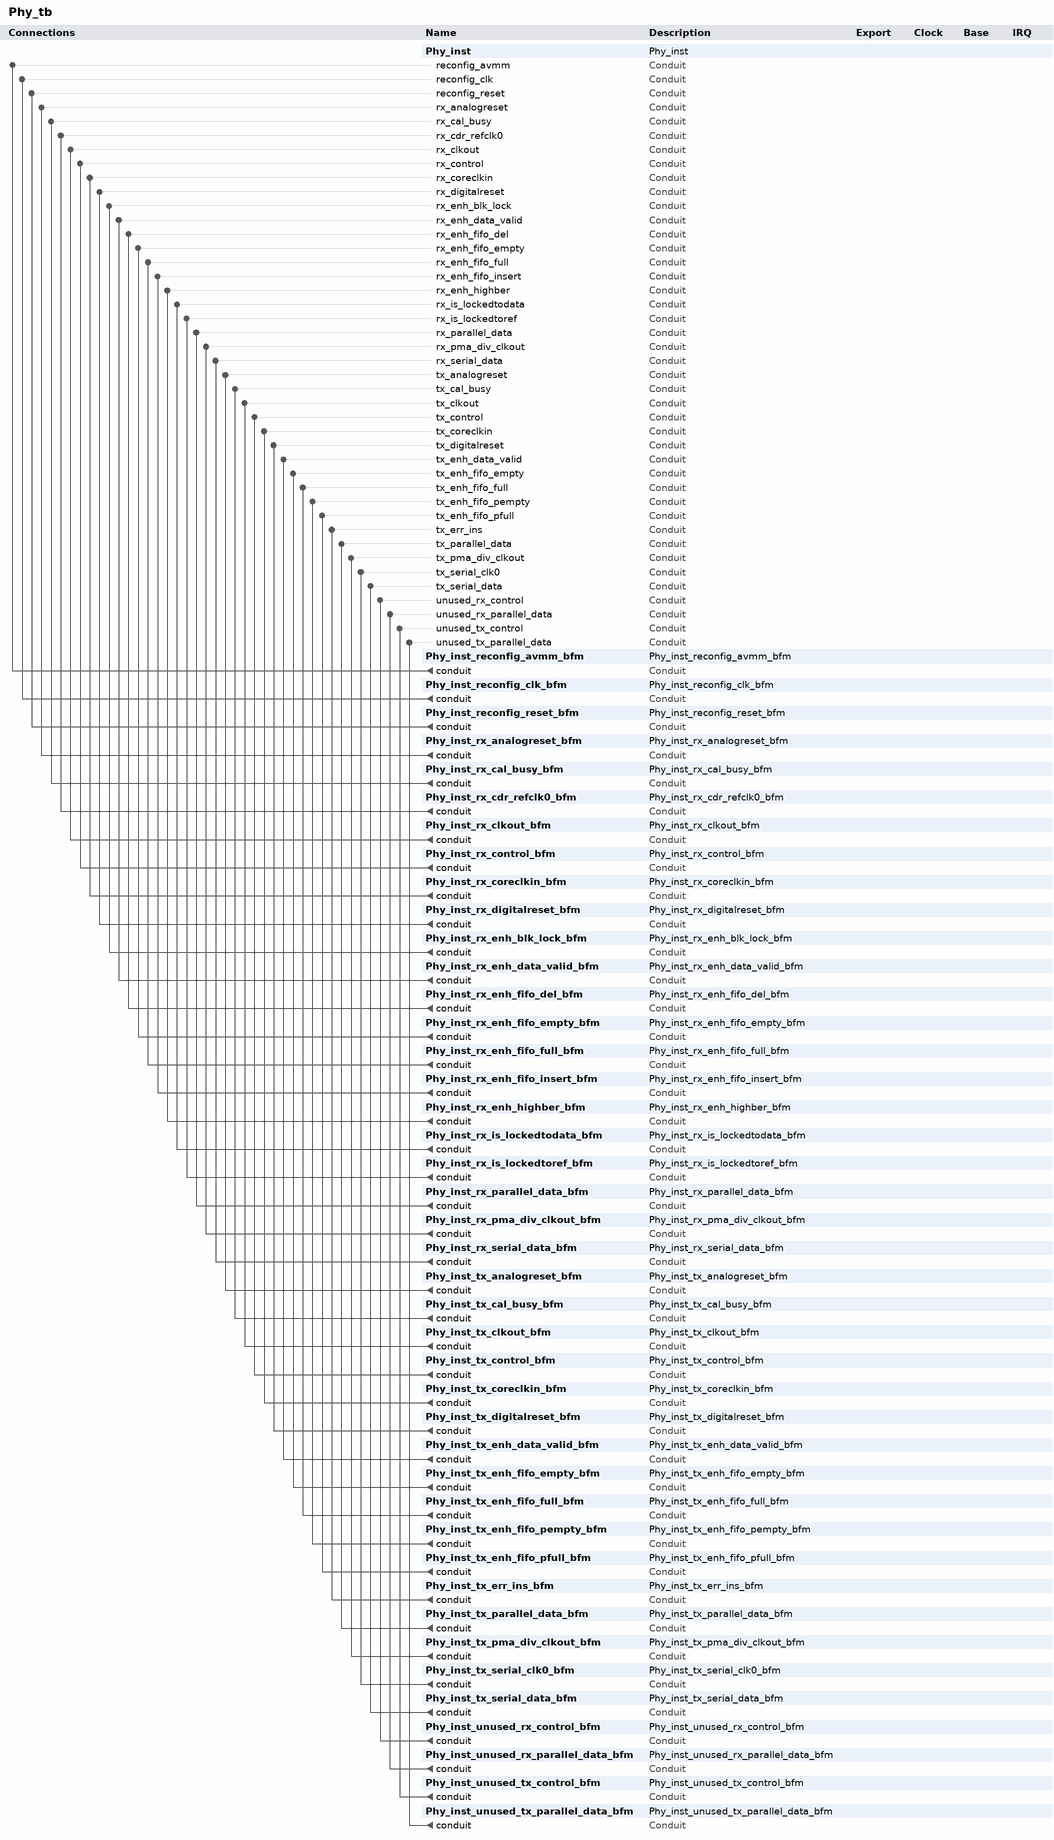
[diagram p0: system contents]
# Platform Designer (Qsys) system Phy_tb, Arria 10 10AT115S2F45E2SG
# Parameters at their usual value, and those the tool derives, are not listed.
package require -exact qsys 1.0
create_system Phy_tb
set_project_property DEVICE_FAMILY {Arria 10}
set_project_property DEVICE 10AT115S2F45E2SG

add_component Phy_inst /home/dai/WorkStation/fpga/project/intel/IPs/XG/Phy.ip Phy_inst Phy_inst 1.0

add_component Phy_inst_reconfig_avmm_bfm ip/Phy_tb/Phy_inst_reconfig_avmm_bfm_ip.ip Phy_inst_reconfig_avmm_bfm Phy_inst_reconfig_avmm_bfm 1.0
load_component Phy_inst_reconfig_avmm_bfm
set_component_parameter_value CLOCKED_SIGNAL false
set_component_parameter_value ENABLE_RESET false
set_component_parameter_value SIGNAL_ROLES address,read,readdata,waitrequest,write,writedata
set_component_parameter_value SIGNAL_WIDTHS 10,1,32,1,1,32
set_component_parameter_value SIGNAL_DIRECTIONS output,output,input,input,output,output
save_component

add_component Phy_inst_reconfig_clk_bfm ip/Phy_tb/Phy_inst_reconfig_clk_bfm_ip.ip Phy_inst_reconfig_clk_bfm Phy_inst_reconfig_clk_bfm 1.0
load_component Phy_inst_reconfig_clk_bfm
set_component_parameter_value CLOCKED_SIGNAL false
set_component_parameter_value ENABLE_RESET false
set_component_parameter_value SIGNAL_ROLES clk
set_component_parameter_value SIGNAL_WIDTHS 1
set_component_parameter_value SIGNAL_DIRECTIONS output
save_component

add_component Phy_inst_reconfig_reset_bfm ip/Phy_tb/Phy_inst_reconfig_reset_bfm_ip.ip Phy_inst_reconfig_reset_bfm Phy_inst_reconfig_reset_bfm 1.0
load_component Phy_inst_reconfig_reset_bfm
set_component_parameter_value CLOCKED_SIGNAL false
set_component_parameter_value ENABLE_RESET false
set_component_parameter_value SIGNAL_ROLES reset
set_component_parameter_value SIGNAL_WIDTHS 1
set_component_parameter_value SIGNAL_DIRECTIONS output
save_component

add_component Phy_inst_rx_analogreset_bfm ip/Phy_tb/Phy_inst_rx_analogreset_bfm_ip.ip Phy_inst_rx_analogreset_bfm Phy_inst_rx_analogreset_bfm 1.0
load_component Phy_inst_rx_analogreset_bfm
set_component_parameter_value CLOCKED_SIGNAL false
set_component_parameter_value ENABLE_RESET false
set_component_parameter_value SIGNAL_ROLES rx_analogreset
set_component_parameter_value SIGNAL_WIDTHS 1
set_component_parameter_value SIGNAL_DIRECTIONS output
save_component

add_component Phy_inst_rx_cal_busy_bfm ip/Phy_tb/Phy_inst_rx_cal_busy_bfm_ip.ip Phy_inst_rx_cal_busy_bfm Phy_inst_rx_cal_busy_bfm 1.0
load_component Phy_inst_rx_cal_busy_bfm
set_component_parameter_value CLOCKED_SIGNAL false
set_component_parameter_value ENABLE_RESET false
set_component_parameter_value SIGNAL_ROLES rx_cal_busy
set_component_parameter_value SIGNAL_WIDTHS 1
set_component_parameter_value SIGNAL_DIRECTIONS input
save_component

add_component Phy_inst_rx_cdr_refclk0_bfm ip/Phy_tb/Phy_inst_rx_cdr_refclk0_bfm_ip.ip Phy_inst_rx_cdr_refclk0_bfm Phy_inst_rx_cdr_refclk0_bfm 1.0
load_component Phy_inst_rx_cdr_refclk0_bfm
set_component_parameter_value CLOCKED_SIGNAL false
set_component_parameter_value ENABLE_RESET false
set_component_parameter_value SIGNAL_ROLES clk
set_component_parameter_value SIGNAL_WIDTHS 1
set_component_parameter_value SIGNAL_DIRECTIONS output
save_component

add_component Phy_inst_rx_clkout_bfm ip/Phy_tb/Phy_inst_rx_clkout_bfm_ip.ip Phy_inst_rx_clkout_bfm Phy_inst_rx_clkout_bfm 1.0
load_component Phy_inst_rx_clkout_bfm
set_component_parameter_value CLOCKED_SIGNAL false
set_component_parameter_value ENABLE_RESET false
set_component_parameter_value SIGNAL_ROLES clk
set_component_parameter_value SIGNAL_WIDTHS 1
set_component_parameter_value SIGNAL_DIRECTIONS input
save_component

add_component Phy_inst_rx_control_bfm ip/Phy_tb/Phy_inst_rx_control_bfm_ip.ip Phy_inst_rx_control_bfm Phy_inst_rx_control_bfm 1.0
load_component Phy_inst_rx_control_bfm
set_component_parameter_value CLOCKED_SIGNAL false
set_component_parameter_value ENABLE_RESET false
set_component_parameter_value SIGNAL_ROLES rx_control
set_component_parameter_value SIGNAL_WIDTHS 8
set_component_parameter_value SIGNAL_DIRECTIONS input
save_component

add_component Phy_inst_rx_coreclkin_bfm ip/Phy_tb/Phy_inst_rx_coreclkin_bfm_ip.ip Phy_inst_rx_coreclkin_bfm Phy_inst_rx_coreclkin_bfm 1.0
load_component Phy_inst_rx_coreclkin_bfm
set_component_parameter_value CLOCKED_SIGNAL false
set_component_parameter_value ENABLE_RESET false
set_component_parameter_value SIGNAL_ROLES clk
set_component_parameter_value SIGNAL_WIDTHS 1
set_component_parameter_value SIGNAL_DIRECTIONS output
save_component

add_component Phy_inst_rx_digitalreset_bfm ip/Phy_tb/Phy_inst_rx_digitalreset_bfm_ip.ip Phy_inst_rx_digitalreset_bfm Phy_inst_rx_digitalreset_bfm 1.0
load_component Phy_inst_rx_digitalreset_bfm
set_component_parameter_value CLOCKED_SIGNAL false
set_component_parameter_value ENABLE_RESET false
set_component_parameter_value SIGNAL_ROLES rx_digitalreset
set_component_parameter_value SIGNAL_WIDTHS 1
set_component_parameter_value SIGNAL_DIRECTIONS output
save_component

add_component Phy_inst_rx_enh_blk_lock_bfm ip/Phy_tb/Phy_inst_rx_enh_blk_lock_bfm_ip.ip Phy_inst_rx_enh_blk_lock_bfm Phy_inst_rx_enh_blk_lock_bfm 1.0
load_component Phy_inst_rx_enh_blk_lock_bfm
set_component_parameter_value CLOCKED_SIGNAL false
set_component_parameter_value ENABLE_RESET false
set_component_parameter_value SIGNAL_ROLES rx_enh_blk_lock
set_component_parameter_value SIGNAL_WIDTHS 1
set_component_parameter_value SIGNAL_DIRECTIONS input
save_component

add_component Phy_inst_rx_enh_data_valid_bfm ip/Phy_tb/Phy_inst_rx_enh_data_valid_bfm_ip.ip Phy_inst_rx_enh_data_valid_bfm Phy_inst_rx_enh_data_valid_bfm 1.0
load_component Phy_inst_rx_enh_data_valid_bfm
set_component_parameter_value CLOCKED_SIGNAL false
set_component_parameter_value ENABLE_RESET false
set_component_parameter_value SIGNAL_ROLES rx_enh_data_valid
set_component_parameter_value SIGNAL_WIDTHS 1
set_component_parameter_value SIGNAL_DIRECTIONS input
save_component

add_component Phy_inst_rx_enh_fifo_del_bfm ip/Phy_tb/Phy_inst_rx_enh_fifo_del_bfm_ip.ip Phy_inst_rx_enh_fifo_del_bfm Phy_inst_rx_enh_fifo_del_bfm 1.0
load_component Phy_inst_rx_enh_fifo_del_bfm
set_component_parameter_value CLOCKED_SIGNAL false
set_component_parameter_value ENABLE_RESET false
set_component_parameter_value SIGNAL_ROLES rx_enh_fifo_del
set_component_parameter_value SIGNAL_WIDTHS 1
set_component_parameter_value SIGNAL_DIRECTIONS input
save_component

add_component Phy_inst_rx_enh_fifo_empty_bfm ip/Phy_tb/Phy_inst_rx_enh_fifo_empty_bfm_ip.ip Phy_inst_rx_enh_fifo_empty_bfm Phy_inst_rx_enh_fifo_empty_bfm 1.0
load_component Phy_inst_rx_enh_fifo_empty_bfm
set_component_parameter_value CLOCKED_SIGNAL false
set_component_parameter_value ENABLE_RESET false
set_component_parameter_value SIGNAL_ROLES rx_enh_fifo_empty
set_component_parameter_value SIGNAL_WIDTHS 1
set_component_parameter_value SIGNAL_DIRECTIONS input
save_component

add_component Phy_inst_rx_enh_fifo_full_bfm ip/Phy_tb/Phy_inst_rx_enh_fifo_full_bfm_ip.ip Phy_inst_rx_enh_fifo_full_bfm Phy_inst_rx_enh_fifo_full_bfm 1.0
load_component Phy_inst_rx_enh_fifo_full_bfm
set_component_parameter_value CLOCKED_SIGNAL false
set_component_parameter_value ENABLE_RESET false
set_component_parameter_value SIGNAL_ROLES rx_enh_fifo_full
set_component_parameter_value SIGNAL_WIDTHS 1
set_component_parameter_value SIGNAL_DIRECTIONS input
save_component

add_component Phy_inst_rx_enh_fifo_insert_bfm ip/Phy_tb/Phy_inst_rx_enh_fifo_insert_bfm_ip.ip Phy_inst_rx_enh_fifo_insert_bfm Phy_inst_rx_enh_fifo_insert_bfm 1.0
load_component Phy_inst_rx_enh_fifo_insert_bfm
set_component_parameter_value CLOCKED_SIGNAL false
set_component_parameter_value ENABLE_RESET false
set_component_parameter_value SIGNAL_ROLES rx_enh_fifo_insert
set_component_parameter_value SIGNAL_WIDTHS 1
set_component_parameter_value SIGNAL_DIRECTIONS input
save_component

add_component Phy_inst_rx_enh_highber_bfm ip/Phy_tb/Phy_inst_rx_enh_highber_bfm_ip.ip Phy_inst_rx_enh_highber_bfm Phy_inst_rx_enh_highber_bfm 1.0
load_component Phy_inst_rx_enh_highber_bfm
set_component_parameter_value CLOCKED_SIGNAL false
set_component_parameter_value ENABLE_RESET false
set_component_parameter_value SIGNAL_ROLES rx_enh_highber
set_component_parameter_value SIGNAL_WIDTHS 1
set_component_parameter_value SIGNAL_DIRECTIONS input
save_component

add_component Phy_inst_rx_is_lockedtodata_bfm ip/Phy_tb/Phy_inst_rx_is_lockedtodata_bfm_ip.ip Phy_inst_rx_is_lockedtodata_bfm Phy_inst_rx_is_lockedtodata_bfm 1.0
load_component Phy_inst_rx_is_lockedtodata_bfm
set_component_parameter_value CLOCKED_SIGNAL false
set_component_parameter_value ENABLE_RESET false
set_component_parameter_value SIGNAL_ROLES rx_is_lockedtodata
set_component_parameter_value SIGNAL_WIDTHS 1
set_component_parameter_value SIGNAL_DIRECTIONS input
save_component

add_component Phy_inst_rx_is_lockedtoref_bfm ip/Phy_tb/Phy_inst_rx_is_lockedtoref_bfm_ip.ip Phy_inst_rx_is_lockedtoref_bfm Phy_inst_rx_is_lockedtoref_bfm 1.0
load_component Phy_inst_rx_is_lockedtoref_bfm
set_component_parameter_value CLOCKED_SIGNAL false
set_component_parameter_value ENABLE_RESET false
set_component_parameter_value SIGNAL_ROLES rx_is_lockedtoref
set_component_parameter_value SIGNAL_WIDTHS 1
set_component_parameter_value SIGNAL_DIRECTIONS input
save_component

add_component Phy_inst_rx_parallel_data_bfm ip/Phy_tb/Phy_inst_rx_parallel_data_bfm_ip.ip Phy_inst_rx_parallel_data_bfm Phy_inst_rx_parallel_data_bfm 1.0
load_component Phy_inst_rx_parallel_data_bfm
set_component_parameter_value CLOCKED_SIGNAL false
set_component_parameter_value ENABLE_RESET false
set_component_parameter_value SIGNAL_ROLES rx_parallel_data
set_component_parameter_value SIGNAL_WIDTHS 64
set_component_parameter_value SIGNAL_DIRECTIONS input
save_component

add_component Phy_inst_rx_pma_div_clkout_bfm ip/Phy_tb/Phy_inst_rx_pma_div_clkout_bfm_ip.ip Phy_inst_rx_pma_div_clkout_bfm Phy_inst_rx_pma_div_clkout_bfm 1.0
load_component Phy_inst_rx_pma_div_clkout_bfm
set_component_parameter_value CLOCKED_SIGNAL false
set_component_parameter_value ENABLE_RESET false
set_component_parameter_value SIGNAL_ROLES clk
set_component_parameter_value SIGNAL_WIDTHS 1
set_component_parameter_value SIGNAL_DIRECTIONS input
save_component

add_component Phy_inst_rx_serial_data_bfm ip/Phy_tb/Phy_inst_rx_serial_data_bfm_ip.ip Phy_inst_rx_serial_data_bfm Phy_inst_rx_serial_data_bfm 1.0
load_component Phy_inst_rx_serial_data_bfm
set_component_parameter_value CLOCKED_SIGNAL false
set_component_parameter_value ENABLE_RESET false
set_component_parameter_value SIGNAL_ROLES rx_serial_data
set_component_parameter_value SIGNAL_WIDTHS 1
set_component_parameter_value SIGNAL_DIRECTIONS output
save_component

add_component Phy_inst_tx_analogreset_bfm ip/Phy_tb/Phy_inst_tx_analogreset_bfm_ip.ip Phy_inst_tx_analogreset_bfm Phy_inst_tx_analogreset_bfm 1.0
load_component Phy_inst_tx_analogreset_bfm
set_component_parameter_value CLOCKED_SIGNAL false
set_component_parameter_value ENABLE_RESET false
set_component_parameter_value SIGNAL_ROLES tx_analogreset
set_component_parameter_value SIGNAL_WIDTHS 1
set_component_parameter_value SIGNAL_DIRECTIONS output
save_component

add_component Phy_inst_tx_cal_busy_bfm ip/Phy_tb/Phy_inst_tx_cal_busy_bfm_ip.ip Phy_inst_tx_cal_busy_bfm Phy_inst_tx_cal_busy_bfm 1.0
load_component Phy_inst_tx_cal_busy_bfm
set_component_parameter_value CLOCKED_SIGNAL false
set_component_parameter_value ENABLE_RESET false
set_component_parameter_value SIGNAL_ROLES tx_cal_busy
set_component_parameter_value SIGNAL_WIDTHS 1
set_component_parameter_value SIGNAL_DIRECTIONS input
save_component

add_component Phy_inst_tx_clkout_bfm ip/Phy_tb/Phy_inst_tx_clkout_bfm_ip.ip Phy_inst_tx_clkout_bfm Phy_inst_tx_clkout_bfm 1.0
load_component Phy_inst_tx_clkout_bfm
set_component_parameter_value CLOCKED_SIGNAL false
set_component_parameter_value ENABLE_RESET false
set_component_parameter_value SIGNAL_ROLES clk
set_component_parameter_value SIGNAL_WIDTHS 1
set_component_parameter_value SIGNAL_DIRECTIONS input
save_component

add_component Phy_inst_tx_control_bfm ip/Phy_tb/Phy_inst_tx_control_bfm_ip.ip Phy_inst_tx_control_bfm Phy_inst_tx_control_bfm 1.0
load_component Phy_inst_tx_control_bfm
set_component_parameter_value CLOCKED_SIGNAL false
set_component_parameter_value ENABLE_RESET false
set_component_parameter_value SIGNAL_ROLES tx_control
set_component_parameter_value SIGNAL_WIDTHS 8
set_component_parameter_value SIGNAL_DIRECTIONS output
save_component

add_component Phy_inst_tx_coreclkin_bfm ip/Phy_tb/Phy_inst_tx_coreclkin_bfm_ip.ip Phy_inst_tx_coreclkin_bfm Phy_inst_tx_coreclkin_bfm 1.0
load_component Phy_inst_tx_coreclkin_bfm
set_component_parameter_value CLOCKED_SIGNAL false
set_component_parameter_value ENABLE_RESET false
set_component_parameter_value SIGNAL_ROLES clk
set_component_parameter_value SIGNAL_WIDTHS 1
set_component_parameter_value SIGNAL_DIRECTIONS output
save_component

add_component Phy_inst_tx_digitalreset_bfm ip/Phy_tb/Phy_inst_tx_digitalreset_bfm_ip.ip Phy_inst_tx_digitalreset_bfm Phy_inst_tx_digitalreset_bfm 1.0
load_component Phy_inst_tx_digitalreset_bfm
set_component_parameter_value CLOCKED_SIGNAL false
set_component_parameter_value ENABLE_RESET false
set_component_parameter_value SIGNAL_ROLES tx_digitalreset
set_component_parameter_value SIGNAL_WIDTHS 1
set_component_parameter_value SIGNAL_DIRECTIONS output
save_component

add_component Phy_inst_tx_enh_data_valid_bfm ip/Phy_tb/Phy_inst_tx_enh_data_valid_bfm_ip.ip Phy_inst_tx_enh_data_valid_bfm Phy_inst_tx_enh_data_valid_bfm 1.0
load_component Phy_inst_tx_enh_data_valid_bfm
set_component_parameter_value CLOCKED_SIGNAL false
set_component_parameter_value ENABLE_RESET false
set_component_parameter_value SIGNAL_ROLES tx_enh_data_valid
set_component_parameter_value SIGNAL_WIDTHS 1
set_component_parameter_value SIGNAL_DIRECTIONS output
save_component

add_component Phy_inst_tx_enh_fifo_empty_bfm ip/Phy_tb/Phy_inst_tx_enh_fifo_empty_bfm_ip.ip Phy_inst_tx_enh_fifo_empty_bfm Phy_inst_tx_enh_fifo_empty_bfm 1.0
load_component Phy_inst_tx_enh_fifo_empty_bfm
set_component_parameter_value CLOCKED_SIGNAL false
set_component_parameter_value ENABLE_RESET false
set_component_parameter_value SIGNAL_ROLES tx_enh_fifo_empty
set_component_parameter_value SIGNAL_WIDTHS 1
set_component_parameter_value SIGNAL_DIRECTIONS input
save_component

add_component Phy_inst_tx_enh_fifo_full_bfm ip/Phy_tb/Phy_inst_tx_enh_fifo_full_bfm_ip.ip Phy_inst_tx_enh_fifo_full_bfm Phy_inst_tx_enh_fifo_full_bfm 1.0
load_component Phy_inst_tx_enh_fifo_full_bfm
set_component_parameter_value CLOCKED_SIGNAL false
set_component_parameter_value ENABLE_RESET false
set_component_parameter_value SIGNAL_ROLES tx_enh_fifo_full
set_component_parameter_value SIGNAL_WIDTHS 1
set_component_parameter_value SIGNAL_DIRECTIONS input
save_component

add_component Phy_inst_tx_enh_fifo_pempty_bfm ip/Phy_tb/Phy_inst_tx_enh_fifo_pempty_bfm_ip.ip Phy_inst_tx_enh_fifo_pempty_bfm Phy_inst_tx_enh_fifo_pempty_bfm 1.0
load_component Phy_inst_tx_enh_fifo_pempty_bfm
set_component_parameter_value CLOCKED_SIGNAL false
set_component_parameter_value ENABLE_RESET false
set_component_parameter_value SIGNAL_ROLES tx_enh_fifo_pempty
set_component_parameter_value SIGNAL_WIDTHS 1
set_component_parameter_value SIGNAL_DIRECTIONS input
save_component

add_component Phy_inst_tx_enh_fifo_pfull_bfm ip/Phy_tb/Phy_inst_tx_enh_fifo_pfull_bfm_ip.ip Phy_inst_tx_enh_fifo_pfull_bfm Phy_inst_tx_enh_fifo_pfull_bfm 1.0
load_component Phy_inst_tx_enh_fifo_pfull_bfm
set_component_parameter_value CLOCKED_SIGNAL false
set_component_parameter_value ENABLE_RESET false
set_component_parameter_value SIGNAL_ROLES tx_enh_fifo_pfull
set_component_parameter_value SIGNAL_WIDTHS 1
set_component_parameter_value SIGNAL_DIRECTIONS input
save_component

add_component Phy_inst_tx_err_ins_bfm ip/Phy_tb/Phy_inst_tx_err_ins_bfm_ip.ip Phy_inst_tx_err_ins_bfm Phy_inst_tx_err_ins_bfm 1.0
load_component Phy_inst_tx_err_ins_bfm
set_component_parameter_value CLOCKED_SIGNAL false
set_component_parameter_value ENABLE_RESET false
set_component_parameter_value SIGNAL_ROLES tx_err_ins
set_component_parameter_value SIGNAL_WIDTHS 1
set_component_parameter_value SIGNAL_DIRECTIONS output
save_component

add_component Phy_inst_tx_parallel_data_bfm ip/Phy_tb/Phy_inst_tx_parallel_data_bfm_ip.ip Phy_inst_tx_parallel_data_bfm Phy_inst_tx_parallel_data_bfm 1.0
load_component Phy_inst_tx_parallel_data_bfm
set_component_parameter_value CLOCKED_SIGNAL false
set_component_parameter_value ENABLE_RESET false
set_component_parameter_value SIGNAL_ROLES tx_parallel_data
set_component_parameter_value SIGNAL_WIDTHS 64
set_component_parameter_value SIGNAL_DIRECTIONS output
save_component

add_component Phy_inst_tx_pma_div_clkout_bfm ip/Phy_tb/Phy_inst_tx_pma_div_clkout_bfm_ip.ip Phy_inst_tx_pma_div_clkout_bfm Phy_inst_tx_pma_div_clkout_bfm 1.0
load_component Phy_inst_tx_pma_div_clkout_bfm
set_component_parameter_value CLOCKED_SIGNAL false
set_component_parameter_value ENABLE_RESET false
set_component_parameter_value SIGNAL_ROLES clk
set_component_parameter_value SIGNAL_WIDTHS 1
set_component_parameter_value SIGNAL_DIRECTIONS input
save_component

add_component Phy_inst_tx_serial_clk0_bfm ip/Phy_tb/Phy_inst_tx_serial_clk0_bfm_ip.ip Phy_inst_tx_serial_clk0_bfm Phy_inst_tx_serial_clk0_bfm 1.0
load_component Phy_inst_tx_serial_clk0_bfm
set_component_parameter_value CLOCKED_SIGNAL false
set_component_parameter_value ENABLE_RESET false
set_component_parameter_value SIGNAL_ROLES clk
set_component_parameter_value SIGNAL_WIDTHS 1
set_component_parameter_value SIGNAL_DIRECTIONS output
save_component

add_component Phy_inst_tx_serial_data_bfm ip/Phy_tb/Phy_inst_tx_serial_data_bfm_ip.ip Phy_inst_tx_serial_data_bfm Phy_inst_tx_serial_data_bfm 1.0
load_component Phy_inst_tx_serial_data_bfm
set_component_parameter_value CLOCKED_SIGNAL false
set_component_parameter_value ENABLE_RESET false
set_component_parameter_value SIGNAL_ROLES tx_serial_data
set_component_parameter_value SIGNAL_WIDTHS 1
set_component_parameter_value SIGNAL_DIRECTIONS input
save_component

add_component Phy_inst_unused_rx_control_bfm ip/Phy_tb/Phy_inst_unused_rx_control_bfm_ip.ip Phy_inst_unused_rx_control_bfm Phy_inst_unused_rx_control_bfm 1.0
load_component Phy_inst_unused_rx_control_bfm
set_component_parameter_value CLOCKED_SIGNAL false
set_component_parameter_value ENABLE_RESET false
set_component_parameter_value SIGNAL_ROLES unused_rx_control
set_component_parameter_value SIGNAL_WIDTHS 12
set_component_parameter_value SIGNAL_DIRECTIONS input
save_component

add_component Phy_inst_unused_rx_parallel_data_bfm ip/Phy_tb/Phy_inst_unused_rx_parallel_data_bfm_ip.ip Phy_inst_unused_rx_parallel_data_bfm Phy_inst_unused_rx_parallel_data_bfm 1.0
load_component Phy_inst_unused_rx_parallel_data_bfm
set_component_parameter_value CLOCKED_SIGNAL false
set_component_parameter_value ENABLE_RESET false
set_component_parameter_value SIGNAL_ROLES unused_rx_parallel_data
set_component_parameter_value SIGNAL_WIDTHS 64
set_component_parameter_value SIGNAL_DIRECTIONS input
save_component

add_component Phy_inst_unused_tx_control_bfm ip/Phy_tb/Phy_inst_unused_tx_control_bfm_ip.ip Phy_inst_unused_tx_control_bfm Phy_inst_unused_tx_control_bfm 1.0

add_component Phy_inst_unused_tx_parallel_data_bfm ip/Phy_tb/Phy_inst_unused_tx_parallel_data_bfm_ip.ip Phy_inst_unused_tx_parallel_data_bfm Phy_inst_unused_tx_parallel_data_bfm 1.0

# connections
add_connection Phy_inst_reconfig_avmm_bfm.conduit Phy_inst.reconfig_avmm conduit
add_connection Phy_inst_reconfig_clk_bfm.conduit Phy_inst.reconfig_clk conduit
add_connection Phy_inst_reconfig_reset_bfm.conduit Phy_inst.reconfig_reset conduit
add_connection Phy_inst_rx_analogreset_bfm.conduit Phy_inst.rx_analogreset conduit
add_connection Phy_inst_rx_cal_busy_bfm.conduit Phy_inst.rx_cal_busy conduit
add_connection Phy_inst_rx_cdr_refclk0_bfm.conduit Phy_inst.rx_cdr_refclk0 conduit
add_connection Phy_inst_rx_clkout_bfm.conduit Phy_inst.rx_clkout conduit
add_connection Phy_inst_rx_control_bfm.conduit Phy_inst.rx_control conduit
add_connection Phy_inst_rx_coreclkin_bfm.conduit Phy_inst.rx_coreclkin conduit
add_connection Phy_inst_rx_digitalreset_bfm.conduit Phy_inst.rx_digitalreset conduit
add_connection Phy_inst_rx_enh_blk_lock_bfm.conduit Phy_inst.rx_enh_blk_lock conduit
add_connection Phy_inst_rx_enh_data_valid_bfm.conduit Phy_inst.rx_enh_data_valid conduit
add_connection Phy_inst_rx_enh_fifo_del_bfm.conduit Phy_inst.rx_enh_fifo_del conduit
add_connection Phy_inst_rx_enh_fifo_empty_bfm.conduit Phy_inst.rx_enh_fifo_empty conduit
add_connection Phy_inst_rx_enh_fifo_full_bfm.conduit Phy_inst.rx_enh_fifo_full conduit
add_connection Phy_inst_rx_enh_fifo_insert_bfm.conduit Phy_inst.rx_enh_fifo_insert conduit
add_connection Phy_inst_rx_enh_highber_bfm.conduit Phy_inst.rx_enh_highber conduit
add_connection Phy_inst_rx_is_lockedtodata_bfm.conduit Phy_inst.rx_is_lockedtodata conduit
add_connection Phy_inst_rx_is_lockedtoref_bfm.conduit Phy_inst.rx_is_lockedtoref conduit
add_connection Phy_inst_rx_parallel_data_bfm.conduit Phy_inst.rx_parallel_data conduit
add_connection Phy_inst_rx_pma_div_clkout_bfm.conduit Phy_inst.rx_pma_div_clkout conduit
add_connection Phy_inst_rx_serial_data_bfm.conduit Phy_inst.rx_serial_data conduit
add_connection Phy_inst_tx_analogreset_bfm.conduit Phy_inst.tx_analogreset conduit
add_connection Phy_inst_tx_cal_busy_bfm.conduit Phy_inst.tx_cal_busy conduit
add_connection Phy_inst_tx_clkout_bfm.conduit Phy_inst.tx_clkout conduit
add_connection Phy_inst_tx_control_bfm.conduit Phy_inst.tx_control conduit
add_connection Phy_inst_tx_coreclkin_bfm.conduit Phy_inst.tx_coreclkin conduit
add_connection Phy_inst_tx_digitalreset_bfm.conduit Phy_inst.tx_digitalreset conduit
add_connection Phy_inst_tx_enh_data_valid_bfm.conduit Phy_inst.tx_enh_data_valid conduit
add_connection Phy_inst_tx_enh_fifo_empty_bfm.conduit Phy_inst.tx_enh_fifo_empty conduit
add_connection Phy_inst_tx_enh_fifo_full_bfm.conduit Phy_inst.tx_enh_fifo_full conduit
add_connection Phy_inst_tx_enh_fifo_pempty_bfm.conduit Phy_inst.tx_enh_fifo_pempty conduit
add_connection Phy_inst_tx_enh_fifo_pfull_bfm.conduit Phy_inst.tx_enh_fifo_pfull conduit
add_connection Phy_inst_tx_err_ins_bfm.conduit Phy_inst.tx_err_ins conduit
add_connection Phy_inst_tx_parallel_data_bfm.conduit Phy_inst.tx_parallel_data conduit
add_connection Phy_inst_tx_pma_div_clkout_bfm.conduit Phy_inst.tx_pma_div_clkout conduit
add_connection Phy_inst_tx_serial_clk0_bfm.conduit Phy_inst.tx_serial_clk0 conduit
add_connection Phy_inst_tx_serial_data_bfm.conduit Phy_inst.tx_serial_data conduit
add_connection Phy_inst_unused_rx_control_bfm.conduit Phy_inst.unused_rx_control conduit
add_connection Phy_inst_unused_rx_parallel_data_bfm.conduit Phy_inst.unused_rx_parallel_data conduit
add_connection Phy_inst_unused_tx_control_bfm.conduit Phy_inst.unused_tx_control conduit
add_connection Phy_inst_unused_tx_parallel_data_bfm.conduit Phy_inst.unused_tx_parallel_data conduit

set_interconnect_requirement {$system} qsys_mm.clockCrossingAdapter HANDSHAKE
set_interconnect_requirement {$system} qsys_mm.enableEccProtection FALSE
set_interconnect_requirement {$system} qsys_mm.insertDefaultSlave FALSE
set_interconnect_requirement {$system} qsys_mm.maxAdditionalLatency 1

save_system Phy_tb.qsys
